# Altium schematic sheet Gagabiro_supply_interface.SchDoc: Gagabiro Power Supply Interface
size 292 x 193 mm; CheckedBy: None; Author: João Victor Colombari Carlet; CompanyName: SEL; DrawnBy: João Victor Colombari Carlet; Engineer: João Victor Colombari Carlet; Organization: SEL; Address1: EESC - USP; Address2: 400, Trabalhador São-Carlense Av.; Address3: 13566-590, São Carlos; Address4: São Paulo, Brazil; SheetNumber: 4; SheetTotal: 4
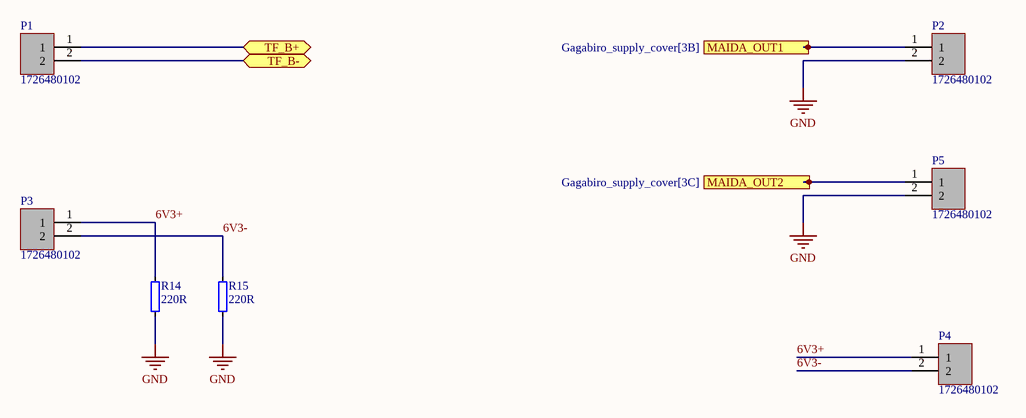
[diagram p0: Gagabiro_supply_interface.SchDoc]

## Parts
P1  1726480102  [MOLEX_1726480102]
P2  1726480102  [MOLEX_1726480102]
P3  1726480102  [MOLEX_1726480102]
P4  1726480102  [MOLEX_1726480102]
P5  1726480102  [MOLEX_1726480102]
R14  220R  [RES_2W_vertical]
R15  220R  [RES_2W_vertical]

## Ports
MAIDA_OUT1 (in, see Gagabiro_supply_cover[3B]), MAIDA_OUT2 (in, see Gagabiro_supply_cover[3C]), TF_B+ (bidir, see Gagabiro_supply_cover[3B], Gagabiro_supply_acdc_converter[2B]), TF_B- (bidir, see Gagabiro_supply_cover[3C], Gagabiro_supply_acdc_converter[2B])

## Nets
GND: P2.2 P5.2 R14.1 R15.1
6V3+: P3.1 P4.1 R14.2
6V3-: P3.2 P4.2 R15.2
MAIDA_OUT1: P2.1 ; port MAIDA_OUT1
MAIDA_OUT2: P5.1 ; port MAIDA_OUT2
TF_B+: P1.1 ; port TF_B+
TF_B-: P1.2 ; port TF_B-

## Notes on the sheet
- Title:
- Drawn By:
- Size:
- Date:
- File:
- A3
- Number:
- Time:
- Revision:
- Sheet
- of
- Website:

## Library data of the parts
P1-P5 = 1726480102: Connector Header Surface Mount, Right Angle 2 position 0.079 (2.00mm); MP: S2B-PH-SM4-TB; MF: JST Sales; Price: None; Availability: In Stock; Package: None; Value: *; SnapEDA_Link: https://www.snapeda.com/parts/S2B-PH-SM4-TB/JST+Sales+America+Inc./view-part/?ref=snap; Purchase-URL: https://pricing.snapeda.com/search/part/S2B-PH-SM4-TB/?ref=eda; Check_prices: https://www.snapeda.com/parts/S2B-PH-SM4-TB/JST+Sales+America+Inc./view-part/?ref=eda
R14 R15 = R_2W_vertical_220R: Resistor, 2W; Part Number: R2W; ComponentLink1URL: N.A.; ComponentLink1Description: Datasheet; ComponentLink2URL: N.A.; ComponentLink2Description: Supplier link; Author: colombari; Value: 220R